# EAGLE design OSO-MISC-20-024 Ring USB Adapter (EAGLE 9.6.2)
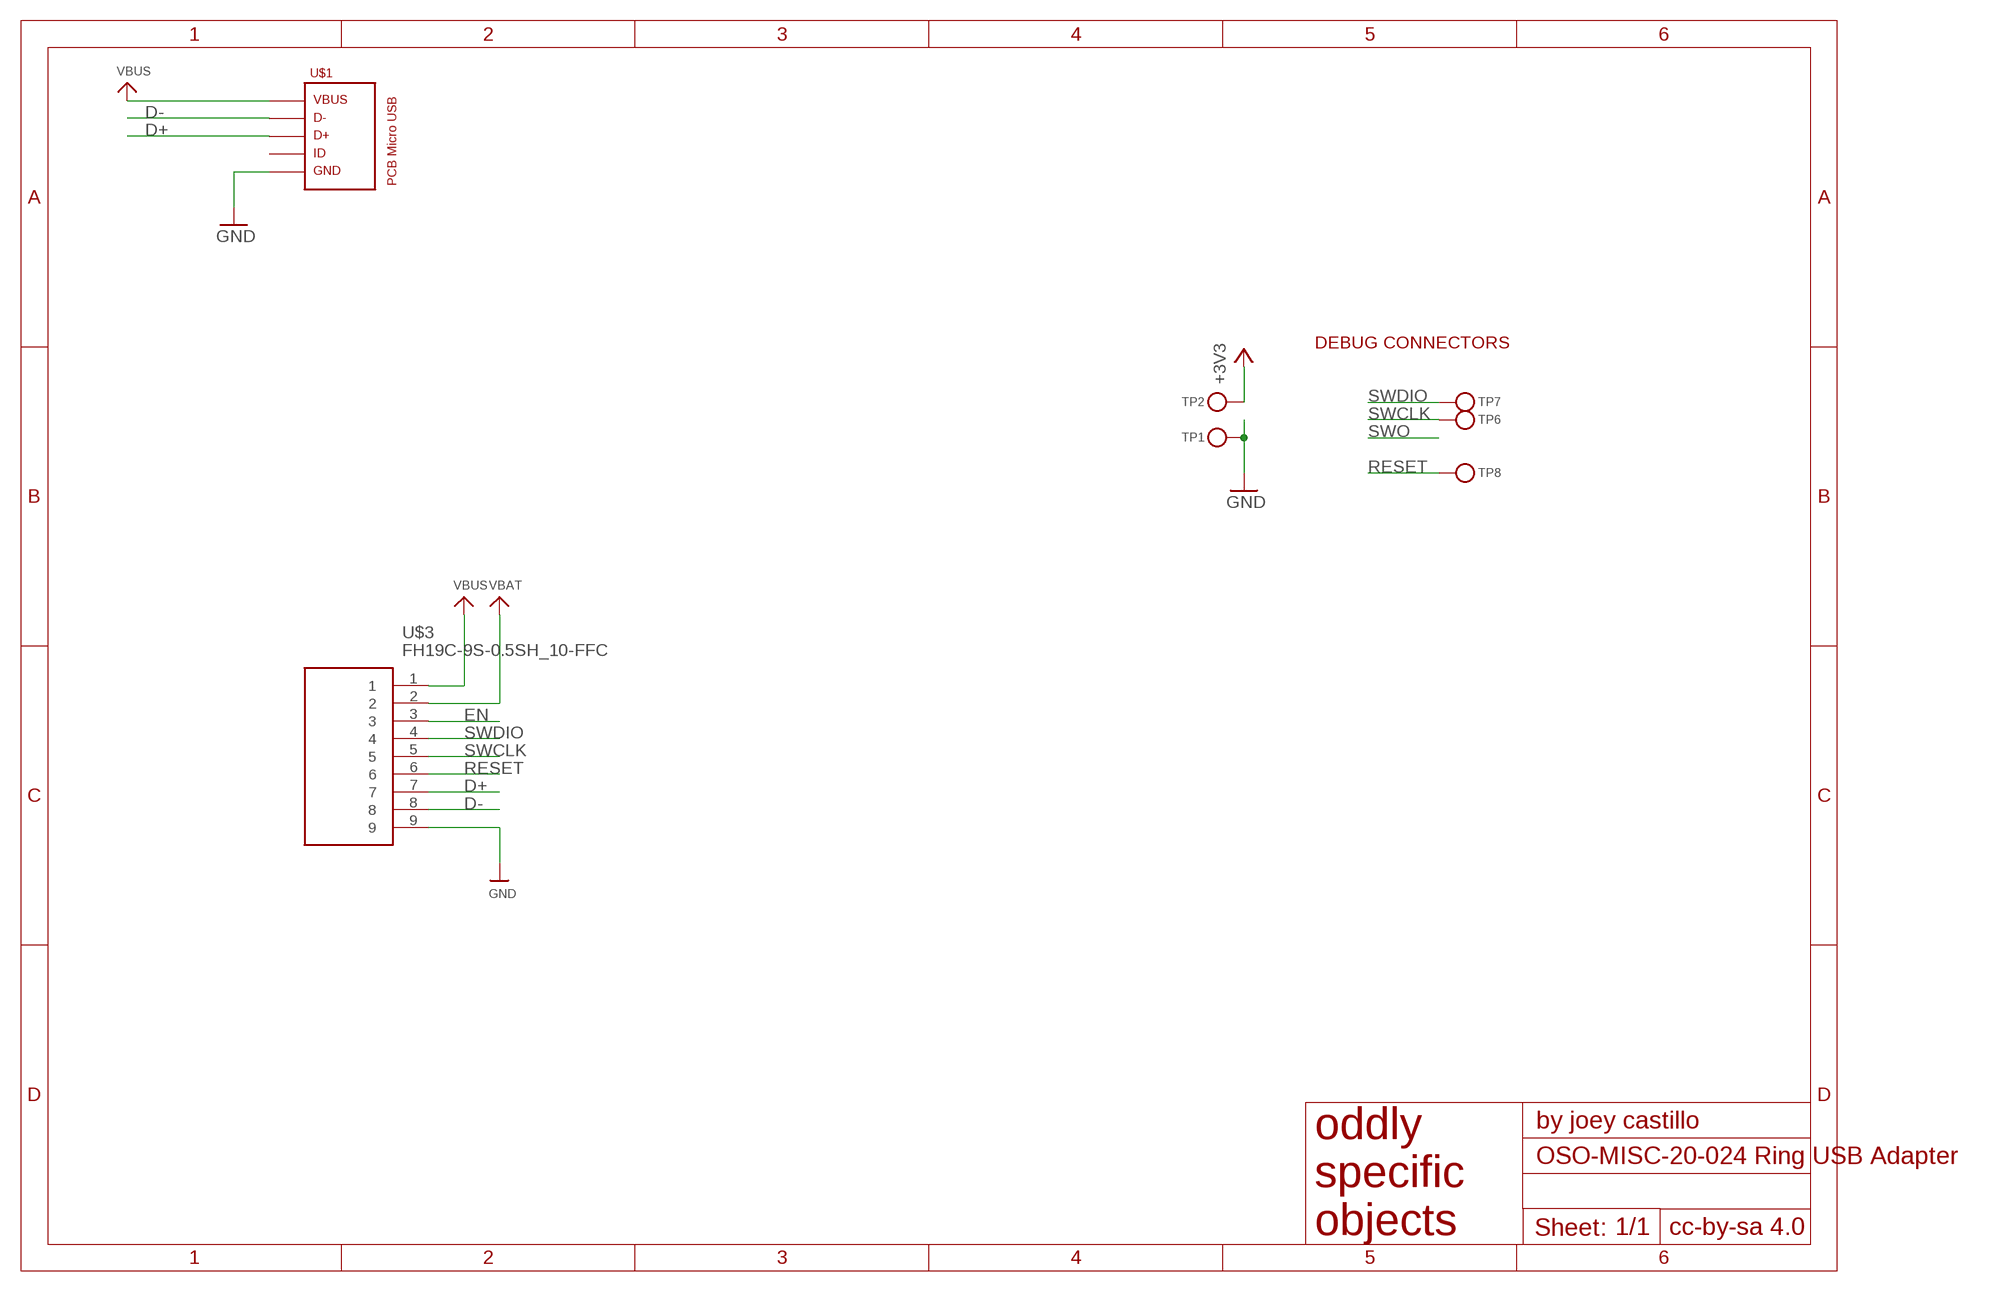
[diagram p0: schematic, sheet 1]

## Parts
TP1  TESTPOINTROUND2MMNO  [TESTPOINT_ROUND_2MM_NO]
TP2  TESTPOINTROUND2MMNO  [TESTPOINT_ROUND_2MM_NO]
TP6  TESTPOINTROUND2MMNO  [TESTPOINT_ROUND_2MM_NO]
TP7  TESTPOINTROUND2MMNO  [TESTPOINT_ROUND_2MM_NO]
TP8  TESTPOINTROUND2MMNO  [TESTPOINT_ROUND_2MM_NO]
U$1  PCB_MICRO_USB_BSS_100  [USB_TYPE_B_SS_100]
U$3  FH19C-9S-0.5SH_10-FFC  [FH19C9S05SH10-FFC]

## Nets
+3V3 [power]: TP2.P$1
D+: U$1.3 U$3.7
D-: U$1.2 U$3.8
EN: U$3.3
GND: TP1.P$1 U$1.5 U$3.9
RESET: TP8.P$1 U$3.6
SWCLK: TP6.P$1 U$3.5
SWDIO: TP7.P$1 U$3.4
VBAT: U$3.2
VBUS: U$1.1 U$3.1
Unconnected: U$1.4

## Notes on the sheet
- DEBUG CONNECTORS

## Library data of the parts
TP1 TP2 TP6-TP8 = microbuilder:TESTPOINT: Test Point Various test points for characterisation and PCB testing TESTPOINT_SMT - Compact Surface Mount Test Point [Digikey: 5016KTR-ND]
U$1 = USB_pcb_connectors:PCB_MICRO_USB_B
U$3 = FH19C-9S-0.5SH:FH19C-9S-0.5SH_10-FFC

## Net classes
1 power: width 0.305 mm

## Board
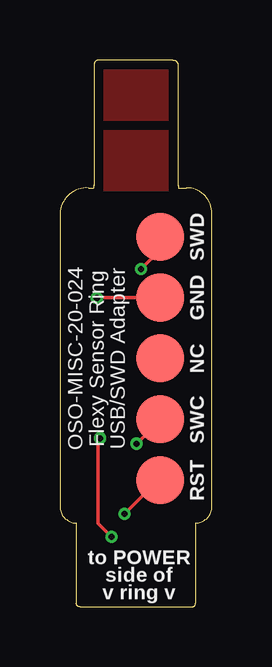
[diagram p1: board, top side]
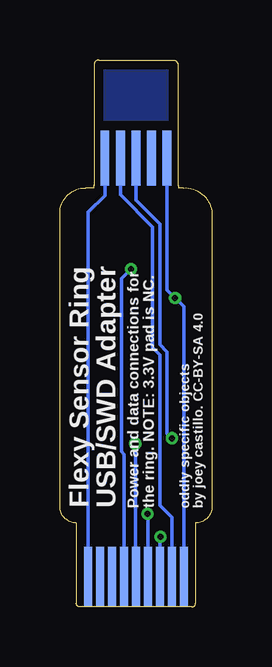
[diagram p2: board, bottom side, seen from below]

Size 6.35 x 22.8 mm. Coordinates in mm from the lower left corner, seen from the top.
Outline: 1.4,17.47 1.19,17.47 arc90 0,16.4 0,4.19 arc90 0.69,3.5
Outline: 4.95,17.47 5.28,17.47 arc-90 6.35,16.4 6.35,4.19 arc-90 5.66,3.5
Copper layers (1*16): Top 0.035559375mm / dielectric 1.6mm / Bottom 0.035559375mm
Design rules "oshpark-2layer *": minimum track width 6mil, minimum drill 10mil, track to track 6mil, track to pad 6mil, pad to pad 6mil, via to via 6mil, smd to smd 6mil, copper to edge 15mil, drill to drill 6mil, minimum pad ring 5mil, minimum via ring 5mil, stop-mask expansion 2.5mil, vias tented up to drill 12mil, thermal gap 10mil

### Footprints (pad centres in the part's own frame; a part is rotated, then mirrored left to right if it is on the bottom)
TESTPOINT_ROUND_2MM_NO = smd 2 x 2: P$1 0,0
USB_TYPE_B_SS_100 = smd 0.37 x 2.3: 1 -1.3,-1.55; 2 -0.65,-1.55; 3 0,-1.55; 4 0.65,-1.55; 5 1.3,-1.55
FH19C9S05SH10-FFC = smd 0.347 x 2.5 bottom: 1 2,-2.25; 2 1.5,-2.25; 3 1,-2.25; 4 0.5,-2.25; 5 0,-2.25; 6 -0.5,-2.25; 7 -1,-2.25; 8 -1.5,-2.25; 9 -2,-2.25

### Placement (x,y rotation side)
TP1  4.19,12.9 90 top
TP2  4.19,10.36 90 top
TP6  4.19,7.82 90 top
TP7  4.19,15.44 90 top
TP8  4.19,5.28 90 top
U$1  3.17,20.26 0 bottom
U$3  3.17,3.5 0 top

### Tracks (layer width: path | path; a pad name or v marks a point on that pad's centre or on a via)
BOTTOM
  pour Bottom: 1.4,22.8 4.95,22.8 4.95,20.39 1.4,20.39
D+  (via drill 0.25)
  Top 0.152: v2.16,2.92 1.6,3.48 1.6,6.95 v1.67,7.03
  Bottom 0.152: U$3.7 2.17,2.9 v2.16,2.92 | U$1.3 3.17,16.96 2.18,15.97 2.18,10.93 1.87,10.63 1.87,7.23 v1.67,7.03
D-
  Bottom 0.152: U$3.8 1.67,3.73 2.18,4.23 2.18,10.5 2.48,10.8 2.48,15.84 3.82,17.18 U$1.2
GND  (via drill 0.25)
  Top 0.152: TP1.P$1 1.56,12.9 v1.54,12.88
  Bottom 0.152: U$1.5 1.87,13.22 v1.54,12.88 1.17,12.52 U$3.9
RESET  (via drill 0.25)
  Top 0.152: TP8.P$1 4.09,5.28 v2.69,3.88
  Bottom 0.152: U$3.6 2.67,3.86 v2.69,3.88
SWCLK  (via drill 0.25)
  Top 0.152: v3.2,6.8 4.19,7.79 TP6.P$1
  Bottom 0.152: v3.2,6.8 3.2,1.28 U$3.5
SWDIO  (via drill 0.25)
  Top 0.152: v3.39,14.08 4.19,14.89 TP7.P$1
  Bottom 0.152: U$3.4 3.67,6.37 3.78,6.48 3.78,13.69 v3.39,14.08
TOP1
  pour Top: 4.95,19.76 1.4,19.76 1.4,17.47 4.95,17.47
TOP2
  pour Top: 4.95,22.8 1.4,22.8 1.4,20.39 4.95,20.39
VBUS
  Bottom 0.152: U$1.1 4.47,17.15 5.17,16.45 U$3.1

### Text on the board
tPlace: SWD | GND | OSO-MISC-20-024 / Flexy Sensor Ring / USB/SWD Adapter | NC | SWC | RST | to POWER / side of / v ring v
bPlace: oddly specific objects / by joey castillo. CC-BY-SA 4.0 | Power and data connections for / the ring. NOTE: 3.3V pad is NC. | Flexy Sensor Ring / USB/SWD Adapter